# EAGLE design Qwiic_Adaptive_Switch_Single (EAGLE 9.6.2)
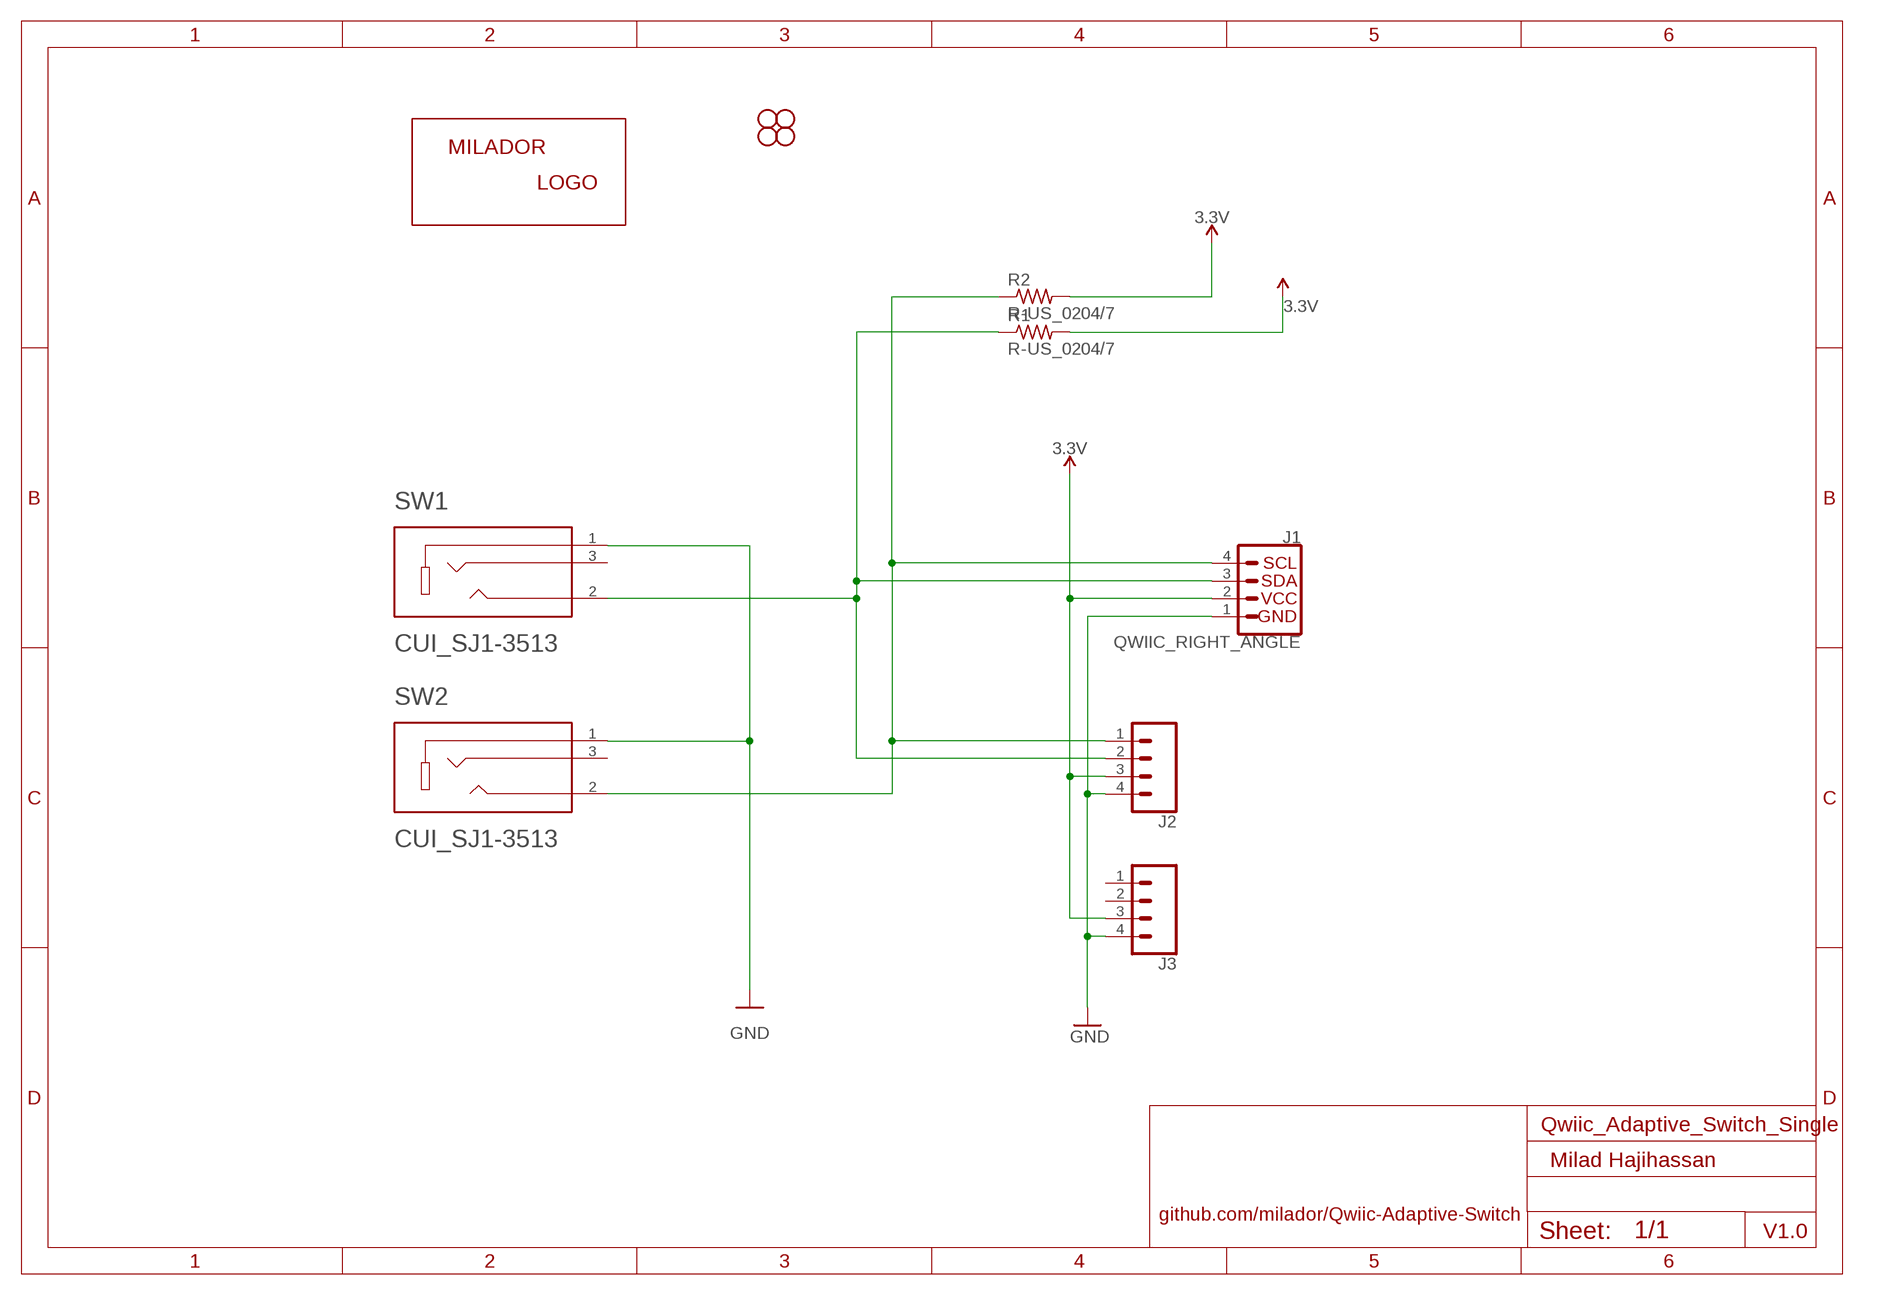
[diagram p0: schematic, sheet 1]

## Parts
J1  QWIIC_RIGHT_ANGLE  QWIIC_CONNECTORSJS-1MM  [CONNECTORS_JST04_1MM_RA]
J2  J2  CONNECTORS_CONN_041X04_NO_SILK  [CONNECTORS_1X04_NO_SILK]
J3  CONNECTORS_CONN_041X04_NO_SILK  [CONNECTORS_1X04_NO_SILK]
JP1  STAND-OFF  [STAND-OFF]
JP2  STAND-OFF  [STAND-OFF]
JP3  STAND-OFF  [STAND-OFF]
JP4  STAND-OFF  [STAND-OFF]
R1  R-US_0204/7  [0204/7]
R2  R-US_0204/7  [0204/7]
SW1  CUI_SJ1-3513  [CUI_SJ1-3513]
SW2  CUI_SJ1-3513  [CUI_SJ1-3513]
U$2  MILADOR-LOGO-  [MILADOR_LOGO1]

## Nets
3.3V: J1.2 J2.3 J3.3 R1.2 R2.2
GND: J1.1 J2.4 J3.4 SW1.1 SW2.1
SCL/SCK: J1.4 J2.1 R2.1 SW2.2
SDA/MOSI: J1.3 J2.2 R1.1 SW1.2
Unconnected: J3.1 J3.2 SW1.3 SW2.3

## Notes on the sheet
- Milad Hajihassan
- github.com/milador/Qwiic-Adaptive-Switch
- V1.0

## Library data of the parts
J1 = milador_SMD:QWIIC_CONNECTORS: SparkFun I2C Standard Qwiic Connector An SMD 1mm pitch JST connector makes it easy and quick (get it? Qwiic?) to connect I2C devices to each other. The Qwiic system <http://www.sparkfun.com/qwiic> enables fast and solderless connection between popular platforms and various sensors and actuators. We carry 200mm <https://www.sparkfun.com/products/14204>, 100mm <https://www.sparkfun.com/products/14205>, 50mm <https://www.sparkfun.com/products/14206>, and breadboard friendly <https://www.sparkfun.com/products/14207> Qwiic cables. We also offer 10 pcs strips <https://www.sparkfun.com/products/14323> the SMD connectors.; PROD_ID: CONN-13694
J2 J3 = milador:CONNECTORS_CONN_04: Multi connection point. Often used as Generic Header-pin footprint for 0.1 inch spaced/style header connections On any of the 0.1 inch spaced packages, you can populate with these: Break Away Headers - Straight <https://www.sparkfun.com/products/116> (PRT-00116) Break Away Male Headers - Right Angle <https://www.sparkfun.com/products/553> (PRT-00553) Female Headers <https://www.sparkfun.com/products/115> (PRT-00115) Break Away Headers - Machine Pin <https://www.sparkfun.com/products/117> (PRT-00117) Break Away Female Headers - Swiss Machine Pin <https://www.sparkfun.com/products/743> (PRT-00743) For SCREWTERMINALS and SPRING TERMINALS visit here: Screw Terimnals on SparkFun.com <https://www.sparkfun.com/search/results?term=Screw+Terminals> (5mm/3.5mm/2.54mm spacing) This device is also useful as a general connection point to wire up your design to another part of your project. Our various solder wires solder well into these plated through hole pads. Hook-Up Wire - Assortment (Stranded, 22 AWG) <https://www.sparkfun.com/products/11375> (PRT-11375) Hook-Up Wire - Assortment (Solid Core, 22 AWG) <https://www.sparkfun.com/products/11367> (PRT-11367) View the entire wire category on our website here <https://www.sparkfun.com/categories/141> Special notes: Molex polarized connector foot print use with SKU : PRT-08231 with associated crimp pins and housings. 1MM SMD Version SKU: PRT-10208; PROD_ID: CONN-09696
JP1-JP4 = SparkFun-Hardware:STAND-OFF: Stand Off Drill holes for mechanically mounting via screws, standoffs, etc. Note: Use the keepout ring to avoid running the screw head into surrounding components. Variant Overviews STAND-OFF - Mechanical footprint for a #4 phillips button head screw. STAND-OFF-TIGHT - Mechanical footprint for a #4 phillips button head screw, Example SparkFun Products Screw - Phillips Head (1/4", 4-40, 10 pack) <https://www.sparkfun.com/products/10453> (PRT-10453) Screw - Phillips Head (1/2", 4-40, 10 pack) <https://www.sparkfun.com/products/10452> (PRT-10452) Screw - Phillips Head (3/4", 4-40, 10 pack) <https://www.sparkfun.com/products/10451> (PRT-10451) Screw - Phillips Head (1", 4-40, 10 pack) <https://www.sparkfun.com/products/10450> (PRT-10450)
R1 R2 = milador:R-US_0204/7
SW1 SW2 = MMC Eagle:CUI_SJ1-3513
U$2 = milador:MILADOR-LOGO-

## Board
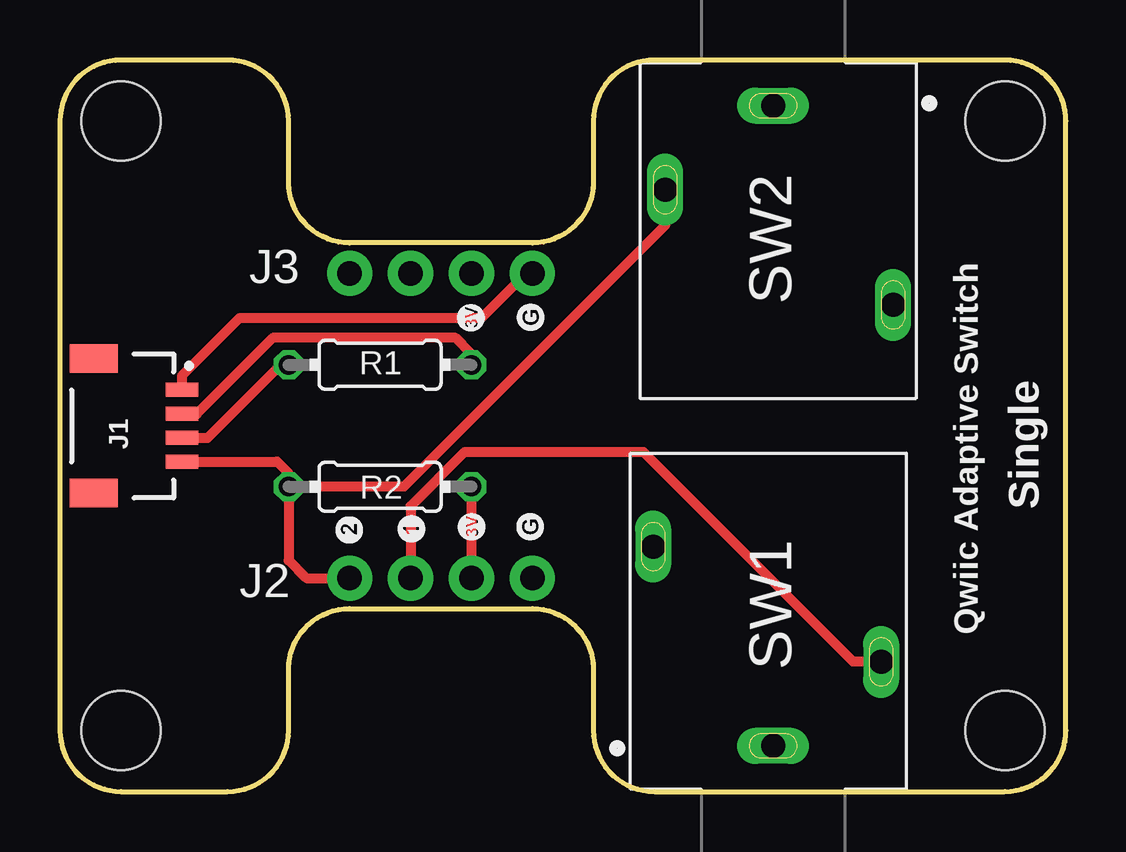
[diagram p1: board, top side]
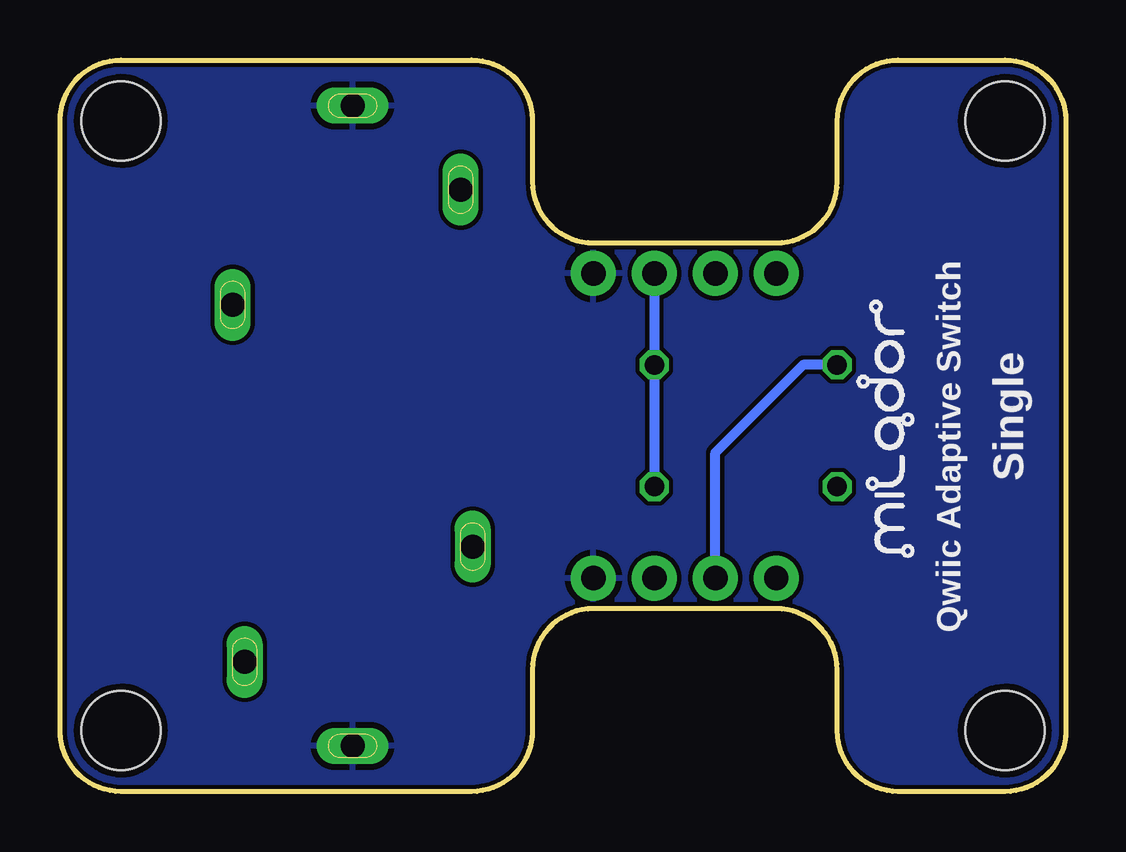
[diagram p2: board, bottom side, seen from below]

Size 41.91 x 30.48 mm. Coordinates in mm from the lower left corner, seen from the top.
Outline: 39.37,30.48 24.77,30.48 arc90 22.23,27.94 22.23,25.4 arc-90 19.69,22.86 12.07,22.86 arc-90 9.53,25.4 9.53,27.94 arc90 6.99,30.48 2.54,30.48 arc90 0,27.94 0,2.54 arc90 2.54,0 6.99,0 arc90 9.53,2.54 9.53,5.08 arc-90 12.07,7.62 19.69,7.62 arc-90 22.23,5.08 22.23,2.54 arc90 24.77,0 39.37,0 arc90 41.91,2.54 41.91,27.94 arc90 39.37,30.48
Copper layers (1*16): Top 0.035mm / dielectric 1.5mm / Bottom 0.035mm
Design rules "SparkFun-2-layer-TIGHT": minimum track width 7mil, minimum drill 15mil, track to track 7mil, track to pad 7mil, pad to pad 7mil, via to via 7mil, smd to smd 7mil, copper to edge 7mil, drill to drill 7mil, minimum pad ring 7mil, minimum via ring 7mil, stop-mask expansion 4mil, vias tented up to drill 25mil, thermal gap 10mil

### Footprints (pad centres in the part's own frame; a part is rotated, then mirrored left to right if it is on the bottom)
CONNECTORS_JST04_1MM_RA = smd 0.6 x 1.35: 1 -1.5,0; 2 -0.5,0; 3 0.5,0; 4 1.5,0 | smd 1.2 x 2: NC1 2.8,-3.675; NC2 -2.8,-3.675
CONNECTORS_1X04_NO_SILK = drill 1.016 pad 1.88: 1 0,0; 2 2.54,0; 3 5.08,0; 4 7.62,0
STAND-OFF = hole 3.302: 0,0
0204/7 = drill 0.813 octagon: 1 -3.81,0; 2 3.81,0
CUI_SJ1-3513 = drill 1 long: 1 0,0; 2 3.5,-4.5; 3 8.3,5

### Placement (x,y rotation side)
J1  5.08,15.24 270 top
J2  12.07,8.89 0 top
J3  12.07,21.59 0 top
JP1  2.54,2.54 0 top
JP2  39.37,2.54 0 top
JP3  2.54,27.94 0 top
JP4  39.37,27.94 0 top
R1  13.34,17.78 0 top
R2  13.34,12.7 0 top
SW1  29.72,1.9 90 top
SW2  29.72,28.58 270 top
U$2  6.35,15.24 90 bottom

### Tracks (layer width: path | path; a pad name or v marks a point on that pad's centre or on a via)
3.3V
  Top 0.406: R2.2 J2.3 | R1.2 17.14,18.24 16.48,18.9 8.87,18.9 5.7,15.73 J1.2
  Bottom 0.406: J3.3 R1.2 R2.2
GND
  Top 0.406: J3.4 19.43,21.59 17.55,19.71 7.47,19.71 5.08,17.32 J1.1
  pour Bottom (rank 2): 0,0 40.64,0 41.91,0 41.91,30.48 0,30.48
SCL/SCK
  Top 0.406: R2.1 9.53,13.26 9.04,13.74 J1.4 | R2.1 14.33,12.7 25.22,23.59 SW2.2 | R2.1 9.53,9.63 10.26,8.89 J2.1
SDA/MOSI
  Top 0.406: R1.1 9.2,17.78 6.15,14.73 J1.3 | SW1.2 33.05,5.41 24.31,14.15 16.87,14.15 14.61,11.89 J2.2
  Bottom 0.406: R1.1 10.95,17.78 14.61,14.12 J2.2

### Text on the board
tPlace: Single | Qwiic Adaptive Switch
bPlace: Single | Qwiic Adaptive Switch